# Altium schematic sheet Sheet1.SchDoc
size A4; SheetNumber: 1; SheetTotal: 1; SPICEModelCacheKZCSYQUI: <root> / <DocumentId>KZCSYQUI</DocumentId> / </root>
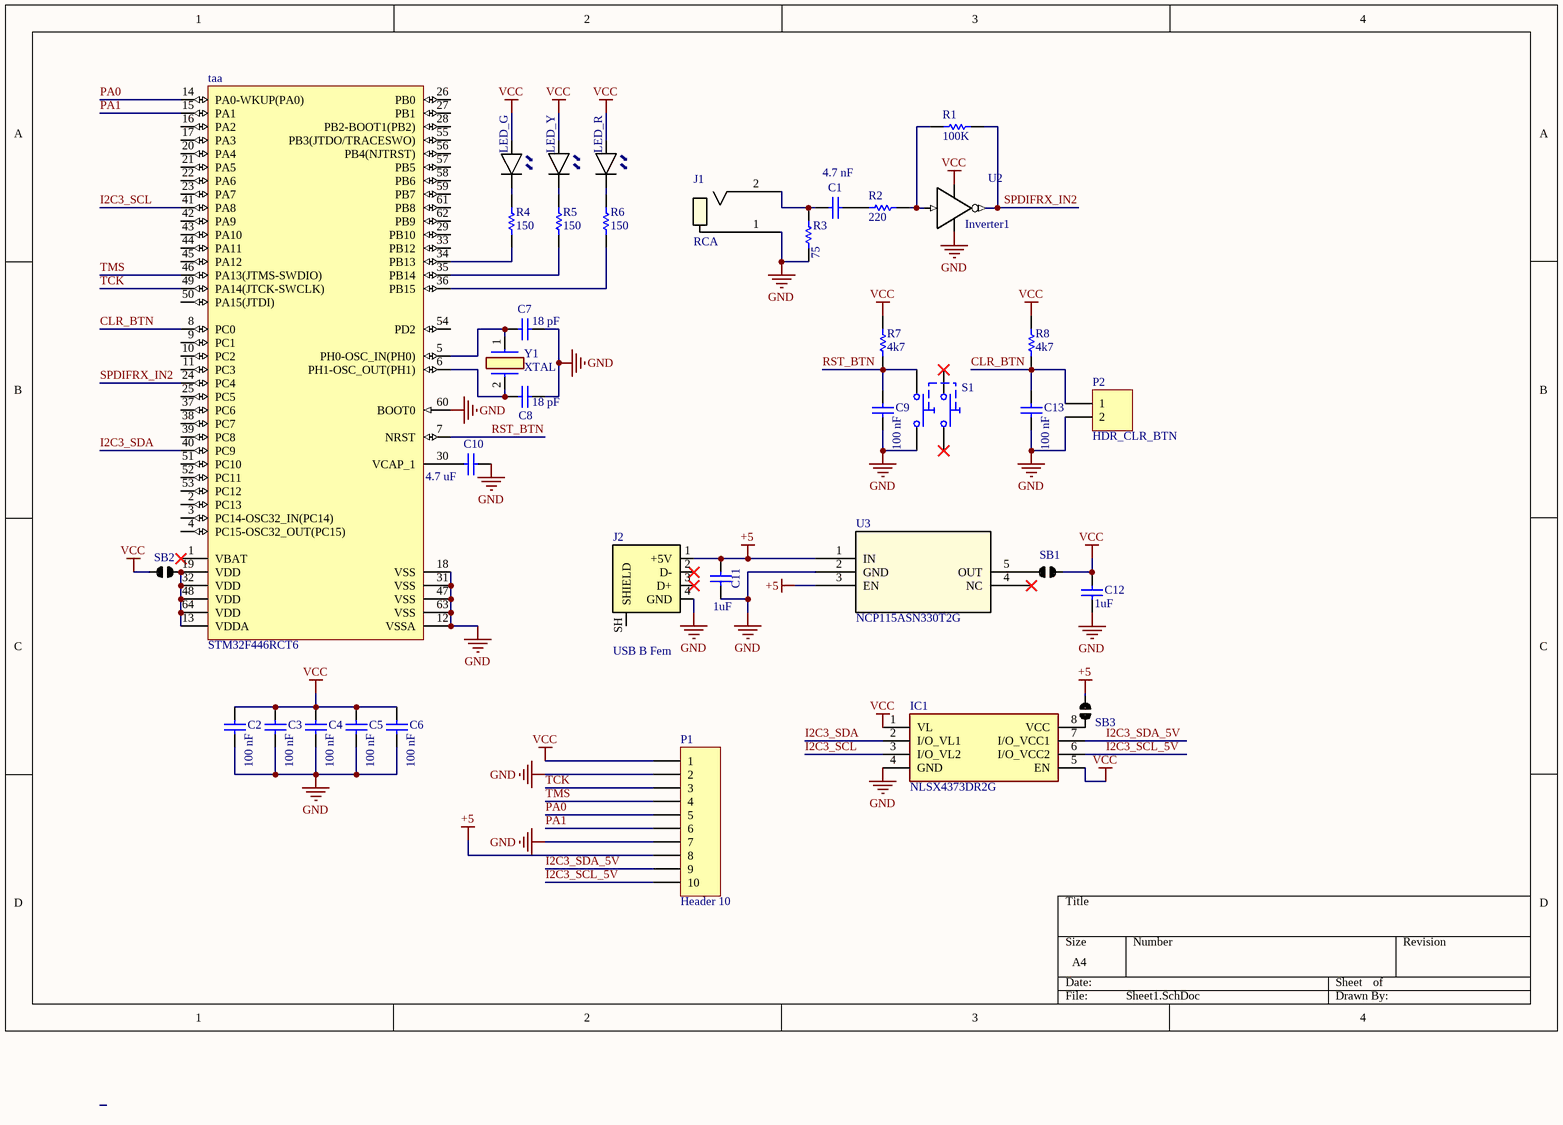
[diagram p0: Sheet1.SchDoc]

## Parts
C1  value 4.7 nF  [RESC3216X70N]  (hidden comment: Cap)
C2  value 100 nF  [RESC3216X70N]  (hidden comment: Cap)
C3  value 100 nF  [RESC3216X70N]  (hidden comment: Cap)
C4  value 100 nF  [RESC3216X70N]  (hidden comment: Cap)
C5  value 100 nF  [RESC3216X70N]  (hidden comment: Cap)
C6  value 100 nF  [RESC3216X70N]  (hidden comment: Cap)
C7  value 18 pF  [RESC3216X70N]  (hidden comment: Cap)
C8  value 18 pF  [RESC3216X70N]  (hidden comment: Cap)
C9  value 100 nF  [RESC3216X70N]  (hidden comment: Cap)
C10  value 4.7 uF  [CAPPRD250W50D655H1250]  (hidden comment: Cap)
C11  value 1uF  [CAPPRD250W50D655H1250]  (hidden comment: Cap)
C12  value 1uF  [CAPPRD250W50D655H1250]  (hidden comment: Cap)
C13  value 100 nF  [RESC3216X70N]  (hidden comment: Cap)
IC1  NLSX4373DR2G  [SOIC127P600X175-8N]
J1  RCA  [KLPX-0848A-2-B_KYC]
J2  USB B Fem  [UJ2BH1TH]
LED_G  fucking led maat hoe moeilijk ist kutprogram  [LED_SSL-LX4673GD-LA20]  (value not drawn)
LED_R  fucking led maat hoe moeilijk ist kutprogram  [LED_SSL-LX4673GD-LA20]  (value not drawn)
LED_Y  fucking led maat hoe moeilijk ist kutprogram  [LED_SSL-LX4673GD-LA20]  (value not drawn)
P1  Header 10  [HDR1X10]
P2  HDR_CLR_BTN  [HDR1X2]
R1  value 100K  [RESC3216X70N]  (hidden comment: Res1)
R2  value 220  [RESC3216X70N]  (hidden comment: Res1)
R3  value 75  [RESC3216X70N]  (hidden comment: Res1)
R4  value 150  [RESC3216X70N]  (hidden comment: Res1)
R5  value 150  [RESC3216X70N]  (hidden comment: Res1)
R6  value 150  [RESC3216X70N]  (hidden comment: Res1)
R7  value 4k7  [RESC3216X70N]  (hidden comment: Res1)
R8  value 4k7  [RESC3216X70N]  (hidden comment: Res1)
S1  Doubl-Pole, Single-Throw Button  [TS026655BK160LCRD]  (value not drawn)
SB1  Solder Bridge  [Solder Bridge]  (value not drawn)
SB2  Solder Bridge  [Solder Bridge]  (value not drawn)
SB3  Solder Bridge  [Solder Bridge]  (value not drawn)
taa  STM32F446RCT6  [STM-LQFP64_L]
U2  Inverter1  [DBV5-M]
U3  NCP115ASN330T2G  [SOT95P275X120-5N]
Y1  XTAL  [ECS80185PXGMTR]

## Nets
+5: C11.2 J2.1(+5V) P1.8 SB3.2 U3.1(IN) U3.3(EN)
GND: C2.1 C3.1 C4.1 C5.1 C6.1 C7.2 C8.2 C9.1 C10.2 C11.1 C12.1 C13.1 IC1.4(GND) J1.1 J2.4(GND) P1.2 P1.7 P2.2 R3.1 S1.4 taa.12(VSSA) taa.18(VSS) taa.31(VSS) taa.47(VSS) taa.60(BOOT0) taa.63(VSS) U2.3(GND) U3.2(GND)
VCC: C2.2 C3.2 C4.2 C5.2 C6.2 C12.2 IC1.1(VL) IC1.5(EN) LED_G.1 LED_R.1 LED_Y.1 P1.1 R7.1 R8.1 SB1.2 SB2.1 U2.5(VCC)
CLR_BTN: C13.2 P2.1 R8.2 taa.8(PC0)
I2C3_SCL: IC1.3(I/O_VL2) taa.41(PA8)
I2C3_SCL_5V: IC1.6(I/O_VCC2) P1.10
I2C3_SDA: IC1.2(I/O_VL1) taa.40(PC9)
I2C3_SDA_5V: IC1.7(I/O_VCC1) P1.9
PA0: P1.5 taa.14(PA0-WKUP(PA0))
PA1: P1.6 taa.15(PA1)
RST_BTN: C9.2 R7.2 S1.3 taa.7(NRST)
SPDIFRX_IN2: R1.1 taa.24(PC4) U2.4(Y)
TCK: P1.3 taa.49(PA14(JTCK-SWCLK))
TMS: P1.4 taa.46(PA13(JTMS-SWDIO))
NetC1_1: C1.1 J1.2 R3.2
NetC1_2: C1.2 R2.2
NetC7_1: C7.1 taa.5(PH0-OSC_IN(PH0)) Y1.1
NetC8_1: C8.1 taa.6(PH1-OSC_OUT(PH1)) Y1.2
NetC10_1: C10.1 taa.30(VCAP_1)
NetIC1_8: IC1.8(VCC) SB3.1
NetLED_G_2: LED_G.2 R4.1
NetLED_R_2: LED_R.2 R6.1
NetLED_Y_2: LED_Y.2 R5.1
NetR1_2: R1.2 R2.1 U2.2(A)
NetR4_2: R4.2 taa.34(PB13)
NetR5_2: R5.2 taa.35(PB14)
NetR6_2: R6.2 taa.36(PB15)
NetSB1_1: SB1.1 U3.5(OUT)
NetSB2_2: SB2.2 taa.13(VDDA) taa.19(VDD) taa.32(VDD) taa.48(VDD) taa.64(VDD)

Not connected (* = marked no-connect by the designer): J2 2(D-)* 3(D+)* SH(SHIELD); S1 1* 2*; taa 1(VBAT)* 2(PC13) 3(PC14-OSC32_IN(PC14)) 4(PC15-OSC32_OUT(PC15)) 9(PC1) 10(PC2) 11(PC3) 16(PA2) 17(PA3) 20(PA4) 21(PA5) 22(PA6) 23(PA7) 25(PC5) 26(PB0) 27(PB1) 28(PB2-BOOT1(PB2)) 29(PB10) 33(PB12) 37(PC6) 38(PC7) 39(PC8) 42(PA9) 43(PA10) 44(PA11) 45(PA12) 50(PA15(JTDI)) 51(PC10) 52(PC11) 53(PC12) 54(PD2) 55(PB3(JTDO/TRACESWO)) 56(PB4(NJTRST)) 57(PB5) 58(PB6) 59(PB7) 61(PB8) 62(PB9); U3 4(NC)*

## Notes on the sheet
- (in symbol fucking led maat hoe moeilijk ist kutprogram) ⬈⬈

## Library data of the parts
C1-C13 = Cap: Capacitor; Published: 8-Jun-2000; LatestRevisionDate: 17-Jul-2002; LatestRevisionNote: Re-released for DXP Platform.; PackageReference: RAD-0.3; Publisher: Altium Limited; PackageDescription: Radial Cap, Thru-Hole; 2 Leads; 0.3 in Pin Spacing
IC1 = NLSX4373DR2G: Integrated Circuit; Manufacturer_Name: onsemi; Datasheet Link: http://www.onsemi.com/pub/Collateral/NLSX4373-D.PDF; Height: 1.75mm; Manufacturer_Part_Number: NLSX4373DR2G; Mouser Part Number: 863-NLSX4373DR2G; Mouser Price/Stock: https://www.mouser.co.uk/ProductDetail/onsemi/NLSX4373DR2G?qs=zXUFZjqEZiiEfIwrZ45LUw%3D%3D; Arrow Part Number: NLSX4373DR2G; Arrow Price/Stock: https://www.arrow.com/en/products/nlsx4373dr2g/on-semiconductor?region=nac
J1 = KLPX-0848A-2-B: No Description Available; Mfr_Name: KYCON, INC.; Copyright: Copyright (C) 2023 Ultra Librarian. All rights reserved.; Manufacturer_Part_Number: KLPX-0848A-2-B; RefDes: RefDes; Type: DEV
J2 = USB B Fem: pin to pad: SH>MH
P1 = Header 10: Header, 10-Pin; LatestRevisionDate: 17-Jul-2002; LatestRevisionNote: Re-released for DXP Platform.; Publisher: Altium Limited
P2 = Header 2: Header, 2-Pin; LatestRevisionDate: 17-Jul-2002; LatestRevisionNote: Re-released for DXP Platform.; Publisher: Altium Limited
R1-R8 = Res1: Resistor; Published: 8-Jun-2000; LatestRevisionDate: 17-Jul-2002; LatestRevisionNote: Re-released for DXP Platform.; PackageReference: AXIAL-0.3; Publisher: Altium Limited; PackageDescription: Axial Device, Thru-Hole; 2 Leads; 0.3 in Pin Spacing
S1 = DPST Push Button: closed: 0; Rclosed: 1m; Ropen: 1Meg; SimulationGenericComponent: True
taa = CMP-0243-00216-1: ARM Cortex-M4 32-bit MCU+FPU, 256 KB Flash, 128 KB Internal RAM, 50 I/Os, 64-Pin LQFP, -40 to 85 degC, Tray; Operating Frequency(F) (Processor speed) (MHz): 180; Internal RAM Size (kB): 128; I/Os (High Current): 50; FLASH Size (Prog) (kB): 256; D/A Converter: 2; Supply Voltage(Vcc) min (V): 1.7; Mounting Technology: Surface Mount; DatasheetVersion: Rev. 6; ComponentLink1URL: http://www.st.com/; Package Description: LQFP64; ComponentLink1Description: Manufacturer URL; Packing: Tray; ComponentLink2Description: Datasheet; Core: ARM Cortex-M4; Package Reference: 64-Pin Low-profile Quad Flat Package, Body 10 x 10 mm, Pitch 0.5 mm; ComponentLink2URL: http://www.st.com/st-web-ui/static/active/en/resource/technical/document/datasheet/DM00141306.pdf
U3 = NCP115ASN330T2G: No Description Available; Mfr_Name: onsemi; Copyright: Copyright (C) 2023 Ultra Librarian. All rights reserved.; Manufacturer_Part_Number: NCP115ASN330T2G; RefDes: RefDes; Type: DEV
Y1 = ECS-80-18-5PX-GM-TR: Crystal or Oscillator; Manufacturer_Name: ECS; Datasheet Link: https://ecsxtal.com/store/pdf/csm-7x.pdf; Height: 4.3mm; Manufacturer_Part_Number: ECS-80-18-5PX-GM-TR; Mouser Part Number: 520-80-18-5PX-GM-TR; Mouser Price/Stock: https://www.mouser.co.uk/ProductDetail/ECS/ECS-80-18-5PX-GM-TR?qs=amGC7iS6iy9i4EiBY7c3iQ%3D%3D
U2 = Inverter1: Supplier 1: Digi-Key; Supplier Part Number 1: 296-8487-1-ND